# Altium project Radio_AKC6955_STM32F030F4.PrjPCB
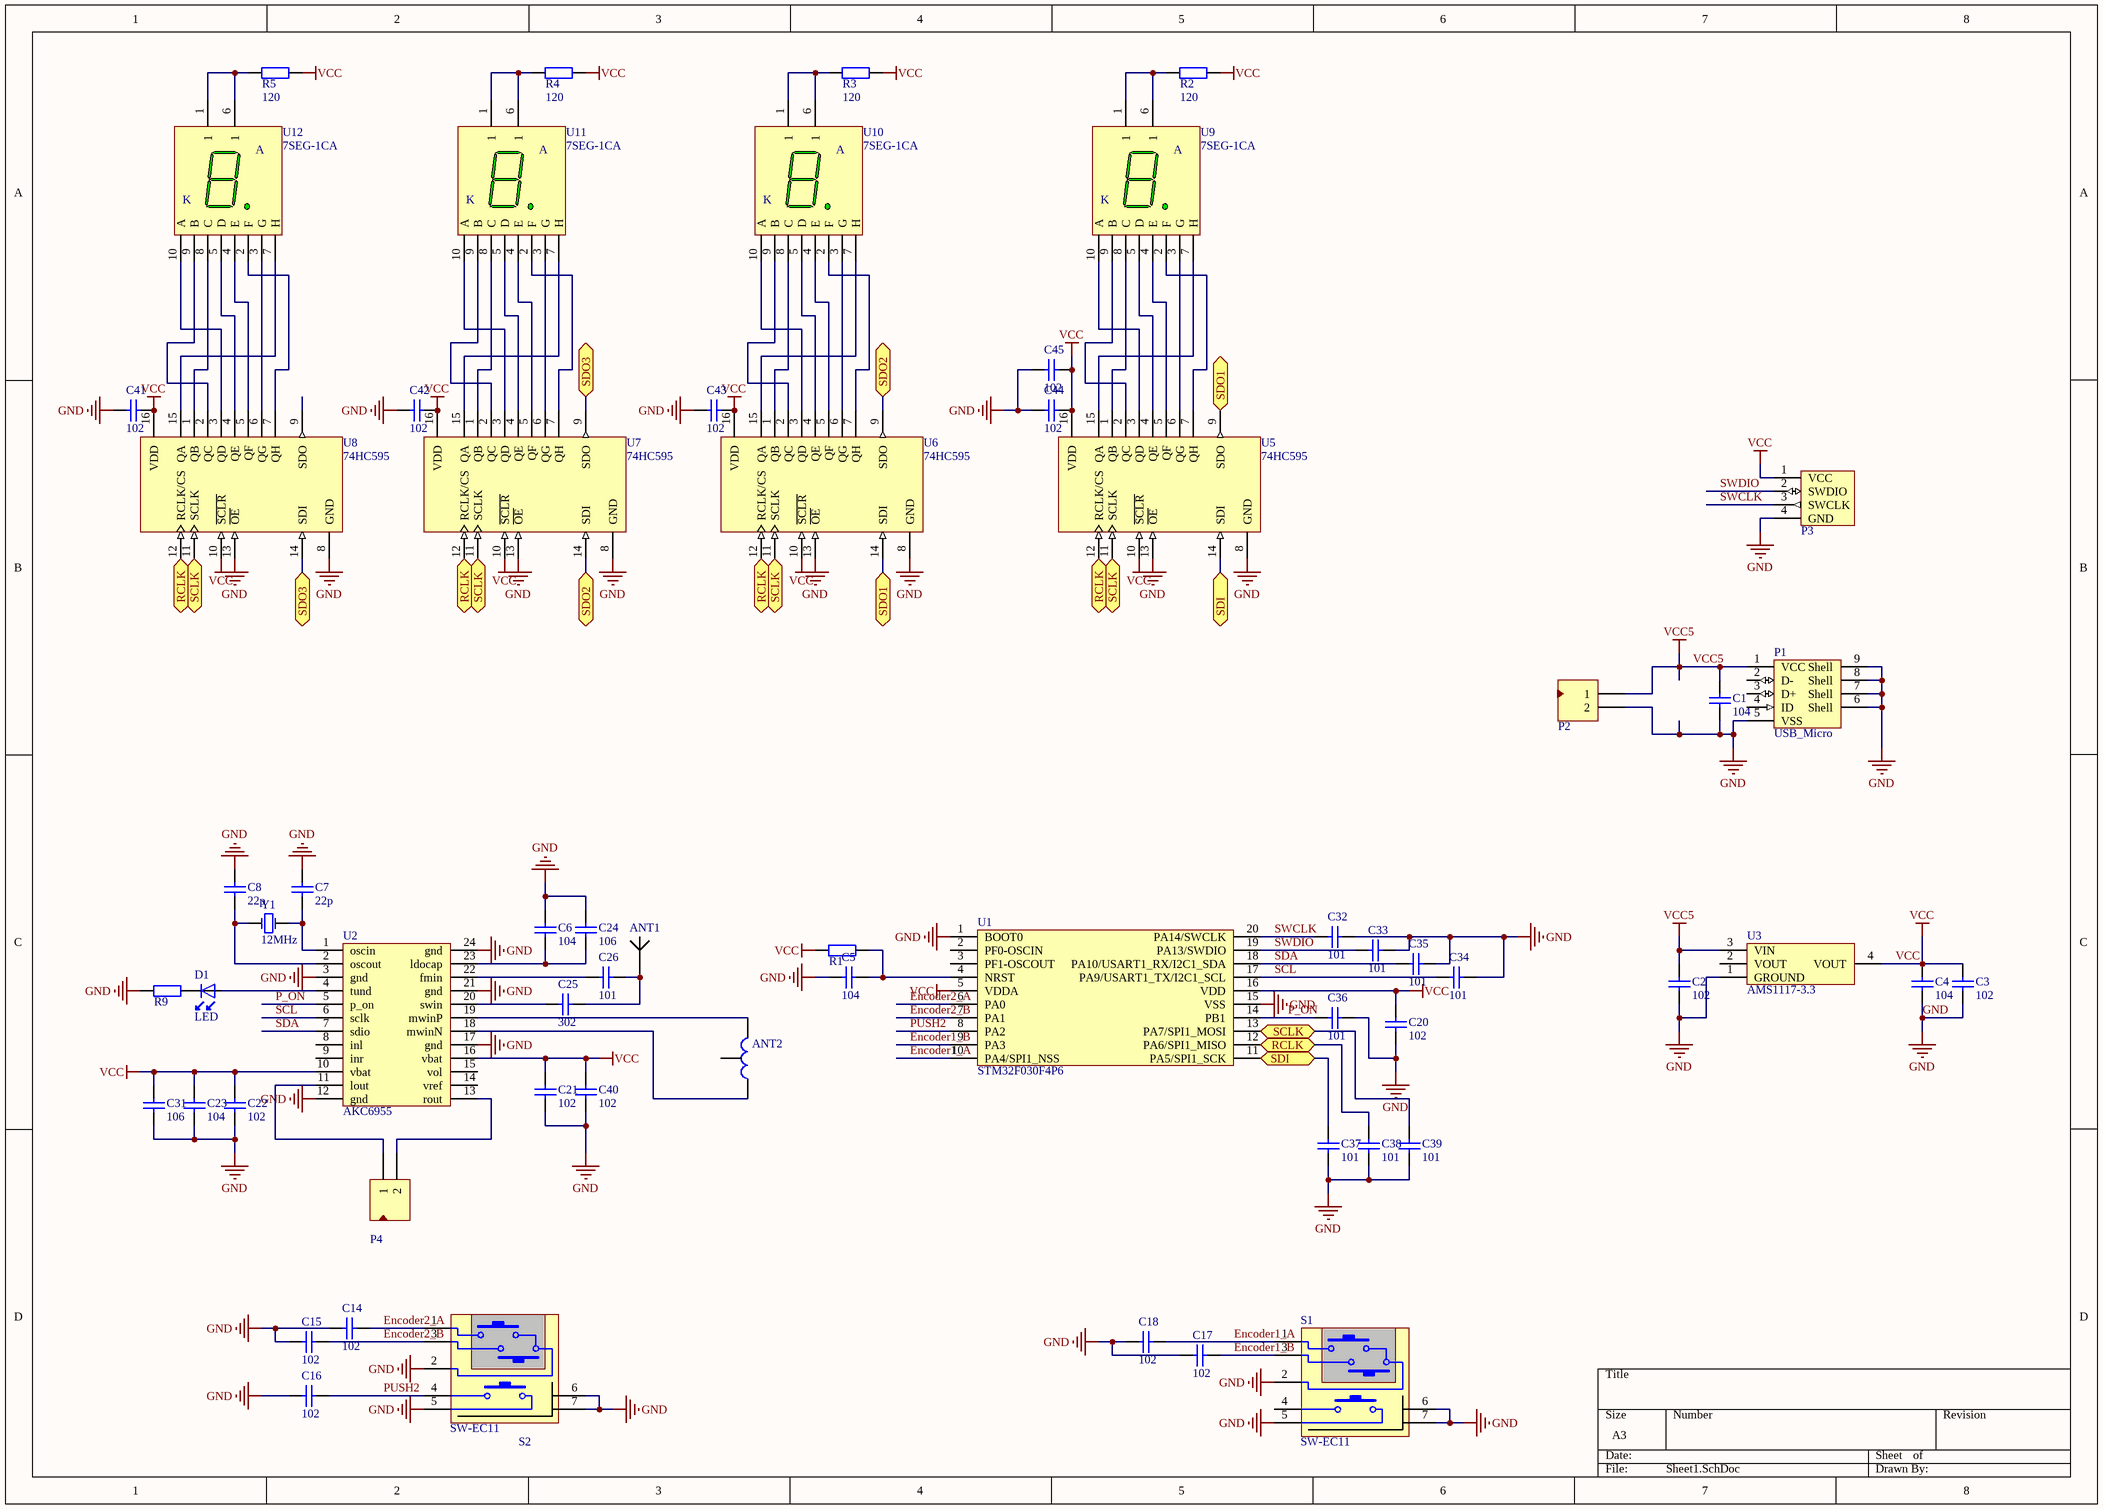
[diagram p0: Sheet1.SchDoc]
1 sheet, 62 parts. Net scope: flat (ports and power ports of the same name join across sheets).
Board file: PCB1.PcbDoc

## Sheet Sheet1.SchDoc
size A3

### Parts
ANT1  ANT-Radio-SW  [ANT-Radio-R7]  (value not drawn)
ANT2  ANT-Radio-MW  [ANT-Radio-MW-8x80]  (value not drawn)
C1  104  [C-0805]
C2  102  [C-0805]
C3  102  [C-0805]
C4  104  [C-0805]
C5  104  [C-0805]
C6  104  [C-0805]
C7  22p  [C-0805]
C8  22p  [C-0805]
C14  102  [C-0805]
C15  102  [C-0805]
C16  102  [C-0805]
C17  102  [C-0805]
C18  102  [C-0805]
C20  102  [C-0805]
C21  102  [C-0805]
C22  102  [C-0805]
C23  104  [C-0805]
C24  106  [C-1210]
C25  302  [C-0805]
C26  101  [C-0805]
C31  106  [C-1210]
C32  101  [C-0805]
C33  101  [C-0805]
C34  101  [C-0805]
C35  101  [C-0805]
C36  101  [C-0805]
C37  101  [C-0805]
C38  101  [C-0805]
C39  101  [C-0805]
C40  102  [C-0805]
C41  102  [C-0805]
C42  102  [C-0805]
C43  102  [C-0805]
C44  102  [C-0805]
C45  102  [C-0805]
D1  LED  [LED-0805]
P1  USB_Micro  [USB-MICRO-3]
P2  Header 2  [XH2.54-2P]  (value not drawn)
P3  SWD  [XH2.54-4P]  (value not drawn)
P4  Header 2  [XH2.54-2P]  (value not drawn)
R1  10k  [0805]  (value not drawn)
R2  120  [0805]
R3  120  [0805]
R4  120  [0805]
R5  120  [0805]
R9  220  [0805]  (value not drawn)
S1  SW-EC11  [SW-EC11]
S2  SW-EC11  [SW-EC11]
U1  STM32F030F4P6  [TSSOP-20]
U2  AKC6955  [TSSOP-24]
U3  AMS1117-3.3  [SOT223]
U5  74HC595  [SOIC-16]
U6  74HC595  [SOIC-16]
U7  74HC595  [SOIC-16]
U8  74HC595  [SOIC-16]
U9  7SEG-1CA  [7-SEG-1BIT-0.36]
U10  7SEG-1CA  [7-SEG-1BIT-0.36]
U11  7SEG-1CA  [7-SEG-1BIT-0.36]
U12  7SEG-1CA  [7-SEG-1BIT-0.36]
Y1  12MHz  [X-5032-2]

### Ports
RCLK, SCLK, SDI, SDO1, SDO2, SDO3

### Nets
GND: C1.1 C2.1 C3.1 C4.1 C5.2 C6.2 C7.2 C8.2 C14.1 C15.1 C16.1 C17.1 C18.1 C20.1 C21.1 C22.1 C23.1 C24.2 C31.1 C32.2 C33.2 C34.2 C35.2 C36.2 C37.1 C38.1 C39.1 C40.1 C41.1 C42.1 C43.1 C44.1 C45.1 P1.5(VSS) P1.6(Shell) P1.7(Shell) P1.8(Shell) P1.9(Shell) P2.2 P3.4(GND) R9.1 S1.2 S1.5 S1.6 S1.7 S2.2 S2.5 S2.6 S2.7 U1.1(BOOT0) U1.15(VSS) U2.3(gnd) U2.12(gnd) U2.17(gnd) U2.21(gnd) U2.24(gnd) U3.1(GROUND) U5.8(GND) U5.13(~{OE}) U6.8(GND) U6.13(~{OE}) U7.8(GND) U7.13(~{OE}) U8.8(GND) U8.13(~{OE})
VCC: C3.2 C4.2 C20.2 C21.2 C22.2 C23.2 C31.2 C40.2 C41.2 C42.2 C43.2 C44.2 C45.2 P3.1(VCC) R1.1 R2.2 R3.2 R4.2 R5.2 U1.5(VDDA) U1.16(VDD) U2.10(vbat) U2.16(vbat) U3.4(VOUT) U5.10(~{SCLR}) U5.16(VDD) U6.10(~{SCLR}) U6.16(VDD) U7.10(~{SCLR}) U7.16(VDD) U8.10(~{SCLR}) U8.16(VDD)
VCC5: C1.2 C2.2 P1.1(VCC) P2.1 U3.3(VIN)
Encoder1_A: C18.2 S1.1 U1.10(PA4/SPI1_NSS)
Encoder1_B: C17.2 S1.3 U1.9(PA3)
Encoder2_A: C14.2 S2.1 U1.6(PA0)
Encoder2_B: C15.2 S2.3 U1.7(PA1)
P_ON: C36.1 U1.14(PB1) U2.5(p_on)
PUSH2: C16.2 S2.4 U1.8(PA2)
SCL: C34.1 U1.17(PA9/USART1_TX/I2C1_SCL) U2.6(sclk)
SDA: C35.1 U1.18(PA10/USART1_RX/I2C1_SDA) U2.7(sdio)
SWCLK: C32.1 P3.3(SWCLK) U1.20(PA14/SWCLK)
SWDIO: C33.1 P3.2(SWDIO) U1.19(PA13/SWDIO)
NetANT1_1: ANT1.1 C25.2 C26.2
NetANT2_1: ANT2.1 U2.19(mwinP)
NetANT2_3: ANT2.3 U2.18(mwinN)
NetC5_1: C5.1 R1.2 U1.4(NRST)
NetC6_1: C6.1 C24.1 U2.23(ldocap)
NetC7_1: C7.1 U2.1(oscin) Y1.2(OSC2)
NetC8_1: C8.1 U2.2(oscout) Y1.1(OSC1)
NetC25_1: C25.1 U2.20(swin)
NetC26_1: C26.1 U2.22(fmin)
NetC37_2: C37.2 U1.11(PA5/SPI1_SCK) U5.14(SDI) ; port SDI
NetC38_2: C38.2 U1.12(PA6/SPI1_MISO) U5.12(RCLK/CS) U6.12(RCLK/CS) U7.12(RCLK/CS) U8.12(RCLK/CS) ; port RCLK
NetC39_2: C39.2 U1.13(PA7/SPI1_MOSI) U5.11(SCLK) U6.11(SCLK) U7.11(SCLK) U8.11(SCLK) ; port SCLK
NetD1_1: D1.1 U2.4(tund)
NetD1_2: D1.2 R9.2
NetP4_1: P4.1 U2.11(lout)
NetP4_2: P4.2 U2.13(rout)
NetR2_1: R2.1 U9.1 U9.6(1)
NetR3_1: R3.1 U10.1 U10.6(1)
NetR4_1: R4.1 U11.1 U11.6(1)
NetR5_1: R5.1 U12.1 U12.6(1)
NetU5_1: U5.1(QB) U9.8(C)
NetU5_2: U5.2(QC) U9.9(B)
NetU5_3: U5.3(QD) U9.10(A)
NetU5_4: U5.4(QE) U9.5(D)
NetU5_5: U5.5(QF) U9.4(E)
NetU5_6: U5.6(QG) U9.3(G)
NetU5_7: U5.7(QH) U9.2(F)
NetU5_9: U5.9(SDO) U6.14(SDI) ; port SDO1
NetU5_15: U5.15(QA) U9.7(H)
NetU6_1: U6.1(QB) U10.8(C)
NetU6_2: U6.2(QC) U10.9(B)
NetU6_3: U6.3(QD) U10.10(A)
NetU6_4: U6.4(QE) U10.5(D)
NetU6_5: U6.5(QF) U10.4(E)
NetU6_6: U6.6(QG) U10.3(G)
NetU6_7: U6.7(QH) U10.2(F)
NetU6_9: U6.9(SDO) U7.14(SDI) ; port SDO2
NetU6_15: U6.15(QA) U10.7(H)
NetU7_1: U7.1(QB) U11.8(C)
NetU7_2: U7.2(QC) U11.9(B)
NetU7_3: U7.3(QD) U11.10(A)
NetU7_4: U7.4(QE) U11.5(D)
NetU7_5: U7.5(QF) U11.4(E)
NetU7_6: U7.6(QG) U11.3(G)
NetU7_7: U7.7(QH) U11.2(F)
NetU7_9: U7.9(SDO) U8.14(SDI) ; port SDO3
NetU7_15: U7.15(QA) U11.7(H)
NetU8_1: U8.1(QB) U12.8(C)
NetU8_2: U8.2(QC) U12.9(B)
NetU8_3: U8.3(QD) U12.10(A)
NetU8_4: U8.4(QE) U12.5(D)
NetU8_5: U8.5(QF) U12.4(E)
NetU8_6: U8.6(QG) U12.3(G)
NetU8_7: U8.7(QH) U12.2(F)
NetU8_15: U8.15(QA) U12.7(H)

Not connected (* = marked no-connect by the designer): ANT2 2; P1 2(D-) 3(D+) 4(ID); S1 4; U1 2(PF0-OSCIN) 3(PF1-OSCOUT); U2 8(inl) 9(inr) 14(vref) 15(vol); U3 2(VOUT); U8 9(SDO)

### Notes on the sheet
- (in symbol 7SEG-1CA) K

### Library data of the parts
ANT1 = ANT-Radio-SW: 收音机拉杆天线
ANT2 = ANT-Radio-MW: 收音机中波磁棒天线
C1-C8 C14-C18 C20-C26 C31-C45 = CAP: 电容; Published: 8-Jun-2000; LatestRevisionDate: 17-Jul-2002; LatestRevisionNote: Re-released for DXP Platform.; Publisher: Altium Limited
P1 = USB-Micro-3: Micro USB
P2 P4 = Header 2: 接插件; LatestRevisionDate: 17-Jul-2002; LatestRevisionNote: Re-released for DXP Platform.; Publisher: Altium Limited
P3 = SWD: SWD接口
R1-R5 R9 = RES: 电阻
S1 S2 = SW-EC11: 旋转编码开关
U1 = STM32F030F4P6: STM32 单片机
U2 = AKC6955: DSP数字收音机芯片
U3 = AMS1117-3.3: 3.3V稳压器
U5-U8 = 74HC595: 移位寄存器; ComponentAvailability: Not for New Design; Published: 15-Apr-2002; LatestRevisionDate: 13-Apr-2006; LatestRevisionNote: IPC-7351 Footprint Added.; DatasheetVersion: 1997; PackageVersion: 1997; PackageReference: 966-01; Publisher: Altium Limited; PackageDescription: 16-Pin Small Outline Package 1.27 mm Pitch; ComponentLink1Description: Manufacturer Link; ComponentLink1URL: http://www.onsemi.com/; ComponentLink2Description: Datasheet; ComponentLink2URL: http://www.onsemi.com/pub/Collateral/MC74VHC595-D.PDF
U9-U12 = 7SEG-1CA: 共阳1位数码管
Y1 = XTAL: 晶振